# EAGLE schematic integrate (EAGLE 9.0.1)
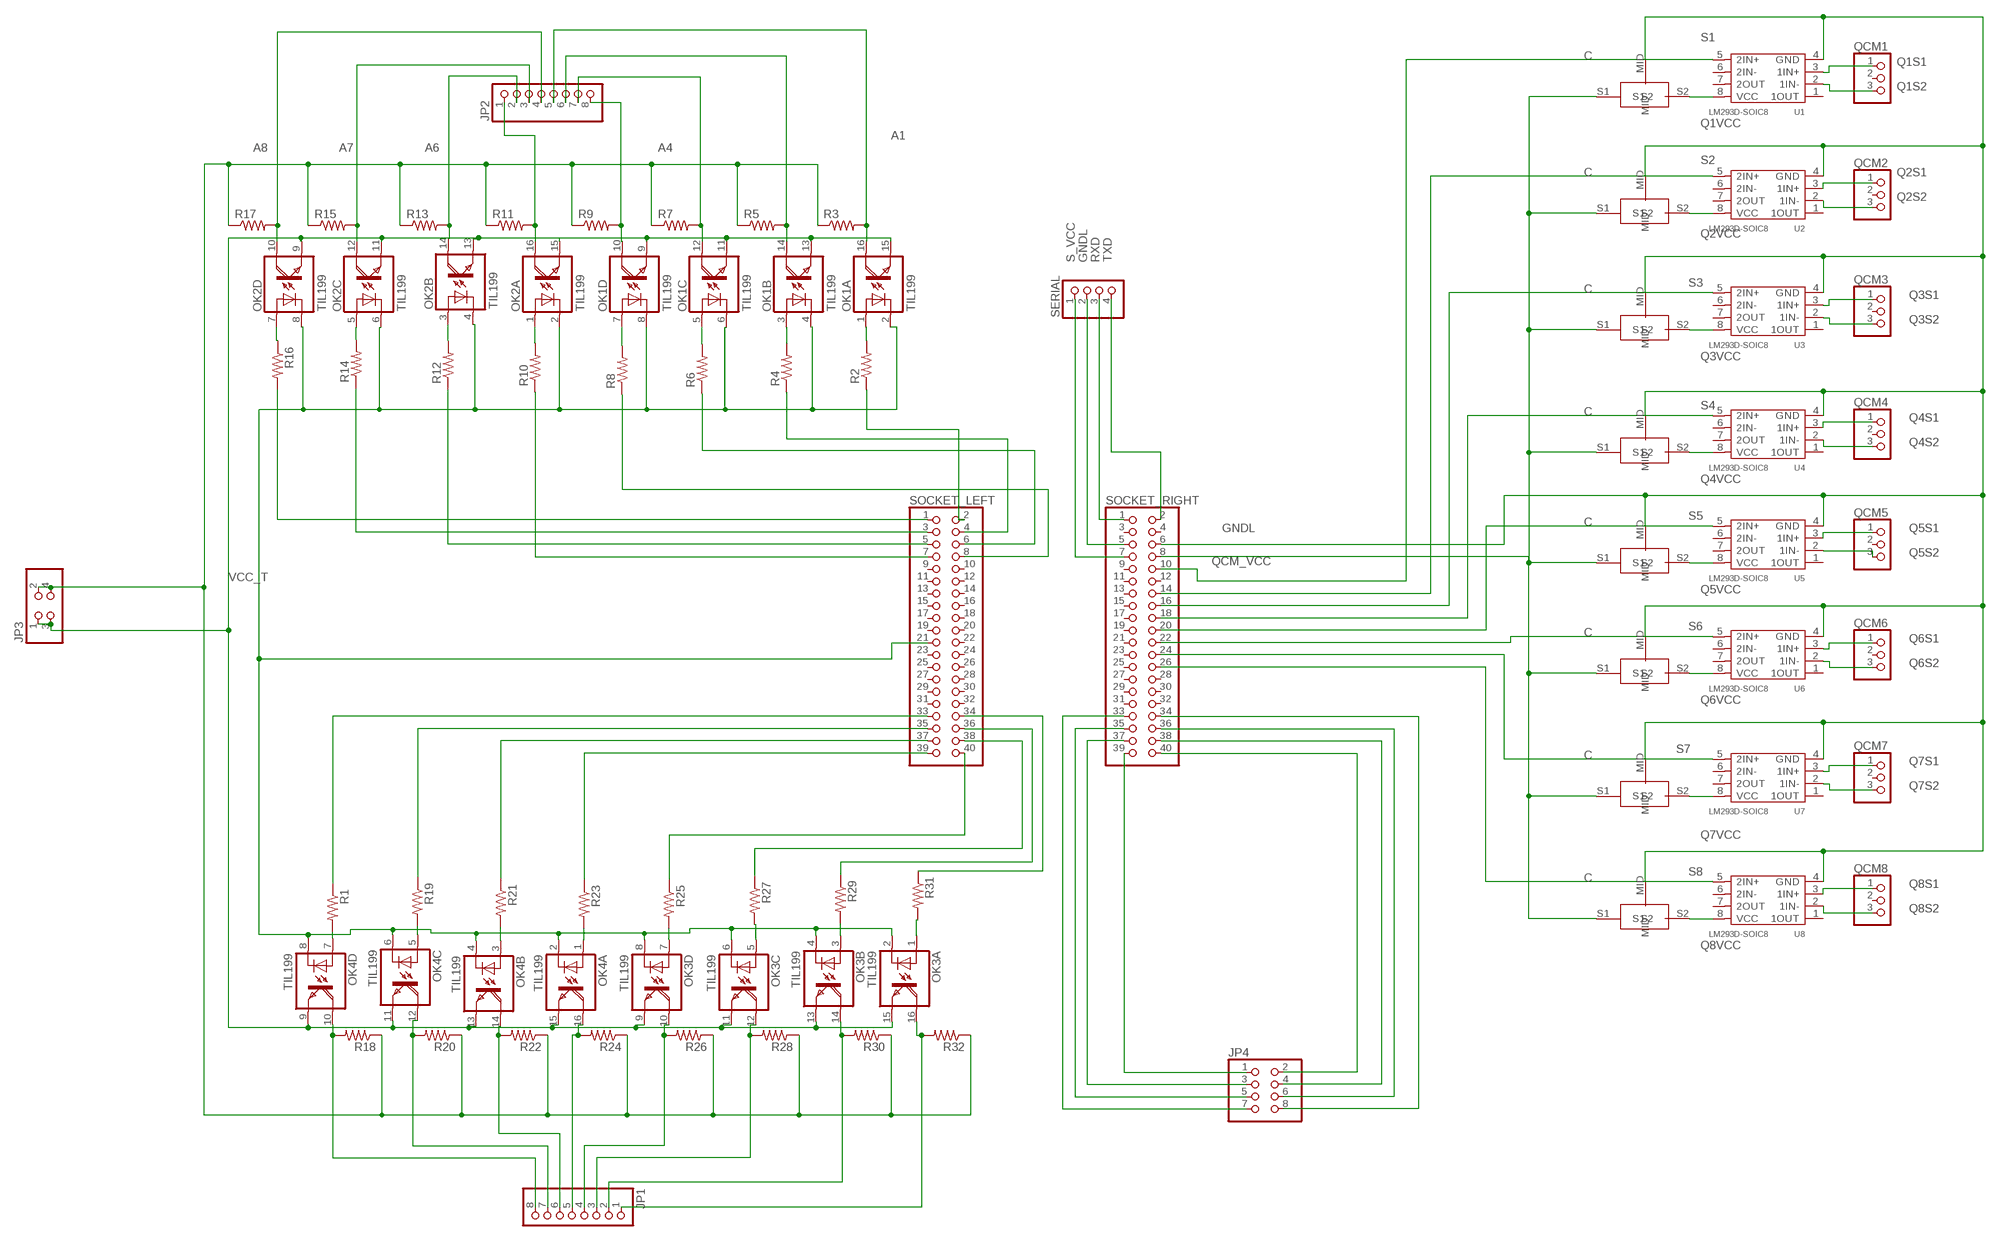
[diagram p0: schematic, sheet 1]

## Parts
JP1  PINHD-1X8  [1X08]
JP2  PINHD-1X8  [1X08]
JP3  PINHD-2X2  [2X02]
JP4  PINHD-2X4  [2X04]
OK1  TIL199  [DIL16]
OK2  TIL199  [DIL16]
OK3  TIL199  [DIL16]
OK4  TIL199  [DIL16]
OSCILLATOR3  CSMD  [C]
OSCILLATOR4  CSMD  [C]
OSCILLATOR5  CSMD  [C]
OSCILLATOR6  CSMD  [C]
OSCILLATOR7  CSMD  [C]
OSCILLATOR8  CSMD  [C]
OSCILLATOR9  CSMD  [C]
OSCILLATOR10  CSMD  [C]
QCM1  PINHD-1X3  [1X03]
QCM2  PINHD-1X3  [1X03]
QCM3  PINHD-1X3  [1X03]
QCM4  PINHD-1X3  [1X03]
QCM5  PINHD-1X3  [1X03]
QCM6  PINHD-1X3  [1X03]
QCM7  PINHD-1X3  [1X03]
QCM8  PINHD-1X3  [1X03]
R1  R-US_0204/7  [0204/7]
R2  R-US_0204/7  [0204/7]
R3  R-US_0204/7  [0204/7]
R4  R-US_0204/7  [0204/7]
R5  R-US_0204/7  [0204/7]
R6  R-US_0204/7  [0204/7]
R7  R-US_0204/7  [0204/7]
R8  R-US_0204/7  [0204/7]
R9  R-US_0204/7  [0204/7]
R10  R-US_0204/7  [0204/7]
R11  R-US_0204/7  [0204/7]
R12  R-US_0204/7  [0204/7]
R13  R-US_0204/7  [0204/7]
R14  R-US_0204/7  [0204/7]
R15  R-US_0204/7  [0204/7]
R16  R-US_0204/7  [0204/7]
R17  R-US_0204/7  [0204/7]
R18  R-US_0204/7  [0204/7]
R19  R-US_0204/7  [0204/7]
R20  R-US_0204/7  [0204/7]
R21  R-US_0204/7  [0204/7]
R22  R-US_0204/7  [0204/7]
R23  R-US_0204/7  [0204/7]
R24  R-US_0204/7  [0204/7]
R25  R-US_0204/7  [0204/7]
R26  R-US_0204/7  [0204/7]
R27  R-US_0204/7  [0204/7]
R28  R-US_0204/7  [0204/7]
R29  R-US_0204/7  [0204/7]
R30  R-US_0204/7  [0204/7]
R31  R-US_0204/7  [0204/7]
R32  R-US_0204/7  [0204/7]
SERIAL  PINHD-1X4  [1X04]
SOCKET_LEFT  PINHD-2X20  [2X20]
SOCKET_RIGHT  PINHD-2X20  [2X20]
U1  LM293D-SOIC8  AMPLIFIER-LM293D(SOIC8)  [SOIC8-1.27-5X4MM]
U2  LM293D-SOIC8  AMPLIFIER-LM293D(SOIC8)  [SOIC8-1.27-5X4MM]
U3  LM293D-SOIC8  AMPLIFIER-LM293D(SOIC8)  [SOIC8-1.27-5X4MM]
U4  LM293D-SOIC8  AMPLIFIER-LM293D(SOIC8)  [SOIC8-1.27-5X4MM]
U5  LM293D-SOIC8  AMPLIFIER-LM293D(SOIC8)  [SOIC8-1.27-5X4MM]
U6  LM293D-SOIC8  AMPLIFIER-LM293D(SOIC8)  [SOIC8-1.27-5X4MM]
U7  LM293D-SOIC8  AMPLIFIER-LM293D(SOIC8)  [SOIC8-1.27-5X4MM]
U8  LM293D-SOIC8  AMPLIFIER-LM293D(SOIC8)  [SOIC8-1.27-5X4MM]

## Nets
A1: JP2.5 OK1.16(A:COL) R3.2
A4: JP2.8 OK1.10(D:COL) R9.2
A6: JP2.2 OK2.14(B:COL) R13.2
A7: JP2.3 OK2.12(C:COL) R15.2
A8: JP2.4 OK2.10(D:COL) R17.2
GNDH: JP3.1 JP3.3 OK1.9(D:EMI) OK1.11(C:EMI) OK1.13(B:EMI) OK1.15(A:EMI) OK2.9(D:EMI) OK2.11(C:EMI) OK2.13(B:EMI) OK2.15(A:EMI) OK3.9(D:EMI) OK3.11(C:EMI) OK3.13(B:EMI) OK3.15(A:EMI) OK4.9(D:EMI) OK4.11(C:EMI) OK4.13(B:EMI) OK4.15(A:EMI)
GNDL: OK1.2(A:C) OK1.4(B:C) OK1.6(C:C) OK1.8(D:C) OK2.2(A:C) OK2.4(B:C) OK2.6(C:C) OK2.8(D:C) OK3.2(A:C) OK3.4(B:C) OK3.6(C:C) OK3.8(D:C) OK4.2(A:C) OK4.4(B:C) OK4.6(C:C) OK4.8(D:C) OSCILLATOR3.MID OSCILLATOR4.MID OSCILLATOR5.MID OSCILLATOR6.MID OSCILLATOR7.MID OSCILLATOR8.MID OSCILLATOR9.MID OSCILLATOR10.MID SERIAL.2 SOCKET_LEFT.21 SOCKET_RIGHT.5 SOCKET_RIGHT.6 U1.4(GND) U2.4(GND) U3.4(GND) U4.4(GND) U5.4(GND) U6.4(GND) U7.4(GND) U8.4(GND)
N$1: JP4.8 SOCKET_RIGHT.34
N$2: R10.1 SOCKET_LEFT.7
N$3: JP4.6 SOCKET_RIGHT.36
N$4: JP4.4 SOCKET_RIGHT.38
N$5: JP4.2 SOCKET_RIGHT.40
N$6: OK4.7(D:A) R1.2
N$7: JP4.5 SOCKET_RIGHT.35
N$8: JP4.3 SOCKET_RIGHT.37
N$9: JP4.1 SOCKET_RIGHT.39
N$10: R12.1 SOCKET_LEFT.5
N$11: R14.1 SOCKET_LEFT.3
N$12: R16.2 SOCKET_LEFT.1
N$13: OK2.7(D:A) R16.1
N$14: OK2.5(C:A) R14.2
N$15: OK2.3(B:A) R12.2
N$16: OK2.1(A:A) R10.2
N$17: R2.1 SOCKET_LEFT.2
N$18: OK1.7(D:A) R8.2
N$19: OK1.1(A:A) R2.2
N$20: OK1.3(B:A) R4.2
N$21: OK1.5(C:A) R6.2
N$22: JP2.6 OK1.14(B:COL) R5.2
N$23: JP2.7 OK1.12(C:COL) R7.2
N$24: JP2.1 OK2.16(A:COL) R11.2
N$25: R4.1 SOCKET_LEFT.4
N$26: R6.1 SOCKET_LEFT.6
N$27: R8.1 SOCKET_LEFT.8
N$28: OK4.5(C:A) R19.2
N$29: OK4.3(B:A) R21.2
N$30: OK4.1(A:A) R23.2
N$31: OK3.7(D:A) R25.2
N$32: OK3.5(C:A) R27.2
N$33: OK3.3(B:A) R29.2
N$34: OK3.1(A:A) R31.2
N$35: JP1.1 OK3.16(A:COL) R32.2
N$36: JP4.7 SOCKET_RIGHT.33
N$37: JP1.2 OK3.14(B:COL) R30.2
N$38: JP1.3 OK3.12(C:COL) R28.2
N$39: JP1.4 OK3.10(D:COL) R26.2
N$40: JP1.5 OK4.16(A:COL) R24.2
N$41: JP1.6 OK4.14(B:COL) R22.2
N$42: JP1.7 OK4.12(C:COL) R20.2
N$43: JP1.8 OK4.10(D:COL) R18.2
N$44: R31.1 SOCKET_LEFT.34
N$46: R29.1 SOCKET_LEFT.36
N$47: R27.1 SOCKET_LEFT.38
N$48: R25.1 SOCKET_LEFT.40
N$49: R23.1 SOCKET_LEFT.39
N$50: R21.1 SOCKET_LEFT.37
N$51: R19.1 SOCKET_LEFT.35
N$52: R1.1 SOCKET_LEFT.33
Q1S1: QCM1.1 U1.3(1IN+)
Q1S2: QCM1.3 U1.2(1IN-)
Q1VCC: OSCILLATOR3.S2 U1.8(VCC)
Q2S1: QCM2.1 U2.3(1IN+)
Q2S2: QCM2.3 U2.2(1IN-)
Q2VCC: OSCILLATOR4.S2 U2.8(VCC)
Q3S1: QCM3.1 U3.3(1IN+)
Q3S2: QCM3.3 U3.2(1IN-)
Q3VCC: OSCILLATOR5.S2 U3.8(VCC)
Q4S1: QCM4.1 U4.3(1IN+)
Q4S2: QCM4.3 U4.2(1IN-)
Q4VCC: OSCILLATOR6.S2 U4.8(VCC)
Q5S1: QCM5.1 U5.3(1IN+)
Q5S2: QCM5.3 U5.2(1IN-)
Q5VCC: OSCILLATOR7.S2 U5.8(VCC)
Q6S1: QCM6.1 U6.3(1IN+)
Q6S2: QCM6.3 U6.2(1IN-)
Q6VCC: OSCILLATOR8.S2 U6.8(VCC)
Q7S1: QCM7.1 U7.3(1IN+)
Q7S2: QCM7.3 U7.2(1IN-)
Q7VCC: OSCILLATOR9.S2 U7.8(VCC)
Q8S1: QCM8.1 U8.3(1IN+)
Q8S2: QCM8.3 U8.2(1IN-)
Q8VCC: OSCILLATOR10.S2 U8.8(VCC)
QCM_VCC: OSCILLATOR3.S1 OSCILLATOR4.S1 OSCILLATOR5.S1 OSCILLATOR6.S1 OSCILLATOR7.S1 OSCILLATOR8.S1 OSCILLATOR9.S1 OSCILLATOR10.S1 SOCKET_RIGHT.8
RXD: SERIAL.3 SOCKET_RIGHT.1
S1: SOCKET_RIGHT.10 U1.5(2IN+)
S2: SOCKET_RIGHT.14 U2.5(2IN+)
S3: SOCKET_RIGHT.16 U3.5(2IN+)
S4: SOCKET_RIGHT.18 U4.5(2IN+)
S5: SOCKET_RIGHT.20 U5.5(2IN+)
S6: SOCKET_RIGHT.22 U6.5(2IN+)
S7: SOCKET_RIGHT.24 U7.5(2IN+)
S8: SOCKET_RIGHT.26 U8.5(2IN+)
S_VCC: SERIAL.1 SOCKET_RIGHT.7
TXD: SERIAL.4 SOCKET_RIGHT.2
VCC_T: JP3.2 JP3.4 R3.1 R5.1 R7.1 R9.1 R11.1 R13.1 R15.1 R17.1 R18.1 R20.1 R22.1 R24.1 R26.1 R28.1 R30.1 R32.1
Unconnected: QCM1.2 QCM2.2 QCM3.2 QCM4.2 QCM5.2 QCM6.2 QCM7.2 QCM8.2 SOCKET_LEFT.9 SOCKET_LEFT.10 SOCKET_LEFT.11 SOCKET_LEFT.12 SOCKET_LEFT.13 SOCKET_LEFT.14 SOCKET_LEFT.15 SOCKET_LEFT.16 SOCKET_LEFT.17 SOCKET_LEFT.18 SOCKET_LEFT.19 SOCKET_LEFT.20 SOCKET_LEFT.22 SOCKET_LEFT.23 SOCKET_LEFT.24 SOCKET_LEFT.25 SOCKET_LEFT.26 SOCKET_LEFT.27 SOCKET_LEFT.28 SOCKET_LEFT.29 SOCKET_LEFT.30 SOCKET_LEFT.31 SOCKET_LEFT.32 SOCKET_RIGHT.3 SOCKET_RIGHT.4 SOCKET_RIGHT.9 SOCKET_RIGHT.11 SOCKET_RIGHT.12 SOCKET_RIGHT.13 SOCKET_RIGHT.15 SOCKET_RIGHT.17 SOCKET_RIGHT.19 SOCKET_RIGHT.21 SOCKET_RIGHT.23 SOCKET_RIGHT.25 SOCKET_RIGHT.27 SOCKET_RIGHT.28 SOCKET_RIGHT.29 SOCKET_RIGHT.30 SOCKET_RIGHT.31 SOCKET_RIGHT.32 U1.1(1OUT) U1.6(2IN-) U1.7(2OUT) U2.1(1OUT) U2.6(2IN-) U2.7(2OUT) U3.1(1OUT) U3.6(2IN-) U3.7(2OUT) U4.1(1OUT) U4.6(2IN-) U4.7(2OUT) U5.1(1OUT) U5.6(2IN-) U5.7(2OUT) U6.1(1OUT) U6.6(2IN-) U6.7(2OUT) U7.1(1OUT) U7.6(2IN-) U7.7(2OUT) U8.1(1OUT) U8.6(2IN-) U8.7(2OUT)

## Library data of the parts
JP1 JP2 = pinhead:PINHD-1X8: PIN HEADER
JP3 = pinhead:PINHD-2X2: PIN HEADER
JP4 = pinhead:PINHD-2X4: PIN HEADER
OK1-OK4 = optocoupler:TIL199: TEXAS INSTRUMENTS OPTO COUPLER; MPN: TIL 199; OC_FARNELL: 1683370; OC_NEWARK: 05R6483
OSCILLATOR3-OSCILLATOR10 = my-library:C
QCM1-QCM8 = pinhead:PINHD-1X3: PIN HEADER
R1-R32 = adafruit:R-US_: RESISTOR, American symbol
SERIAL = pinhead:PINHD-1X4: PIN HEADER
SOCKET_LEFT SOCKET_RIGHT = pinhead:PINHD-2X20: PIN HEADER
U1-U8 = Seeed-IC:AMPLIFIER-LM293D(SOIC8): 310020016; MPN: LM293D

## Net classes
0 default: width 0.762 mm